# EAGLE design RC_BD_v2.1 (EAGLE 9.6.2)
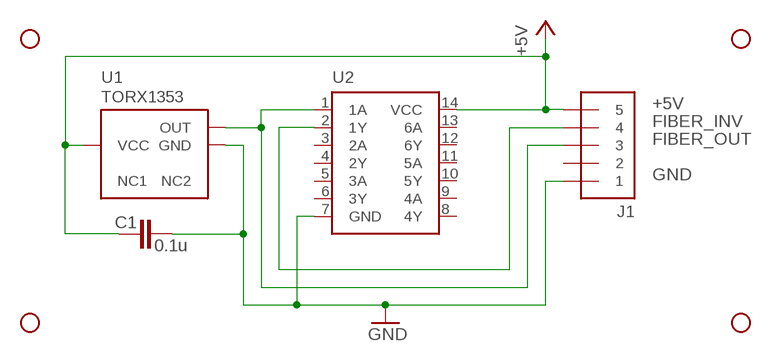
[diagram p0: schematic, sheet 1]

## Parts
C1  0.1u  C_CHIP-1206(3216-METRIC)  [CAPC3216X135]
H1  STAND-OFF  [STAND-OFF]
H2  STAND-OFF  [STAND-OFF]
H3  STAND-OFF  [STAND-OFF]
H4  STAND-OFF  [STAND-OFF]
J1  PPTC051LFBN-RC  [HDR-5-F]
U1  TORX1353  [TOXX1353]
U2  SN74HC04AN  [DIL14]

## Nets
+5V: C1.1 J1.5 U1.3(VCC) U2.14(VCC)
FIBER_INV: J1.4 U2.2(1Y)
FIBER_OUT: J1.3 U1.1(OUT) U2.1(1A)
GND: C1.2 J1.1 U1.2(GND) U2.7(GND)
Unconnected: J1.2 U1.4(NC1) U1.5(NC2) U2.3(2A) U2.4(2Y) U2.5(3A) U2.6(3Y) U2.8(4Y) U2.9(4A) U2.10(5Y) U2.11(5A) U2.12(6Y) U2.13(6A)

## Library data of the parts
C1 = Capacitor:C: Capacitor - Generic; CATEGORY: Capacitor
H1-H4 = SparkFun-Hardware:STAND-OFF: Stand Off Drill holes for mechanically mounting via screws, standoffs, etc. Note: Use the keepout ring to avoid running the screw head into surrounding components. Variant Overviews STAND-OFF - Mechanical footprint for a #4 phillips button head screw. STAND-OFF-TIGHT - Mechanical footprint for a #4 phillips button head screw, Example SparkFun Products Screw - Phillips Head (1/4", 4-40, 10 pack) <https://www.sparkfun.com/products/10453> (PRT-10453) Screw - Phillips Head (1/2", 4-40, 10 pack) <https://www.sparkfun.com/products/10452> (PRT-10452) Screw - Phillips Head (3/4", 4-40, 10 pack) <https://www.sparkfun.com/products/10451> (PRT-10451) Screw - Phillips Head (1", 4-40, 10 pack) <https://www.sparkfun.com/products/10450> (PRT-10450)
J1 = SD_LIB:PPTC051LFBN-RC
U1 = SD_LIB:TORX1353
U2 = SD_LIB:SN74HC04AN

## Board
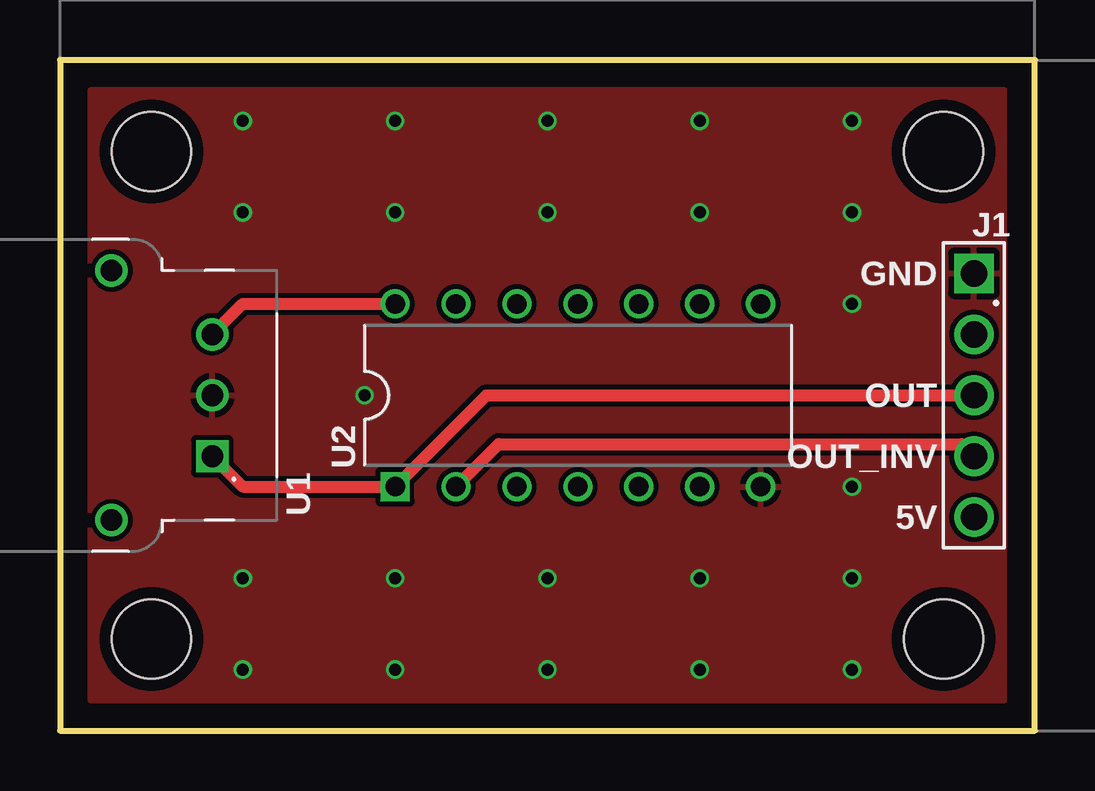
[diagram p1: board, top side]
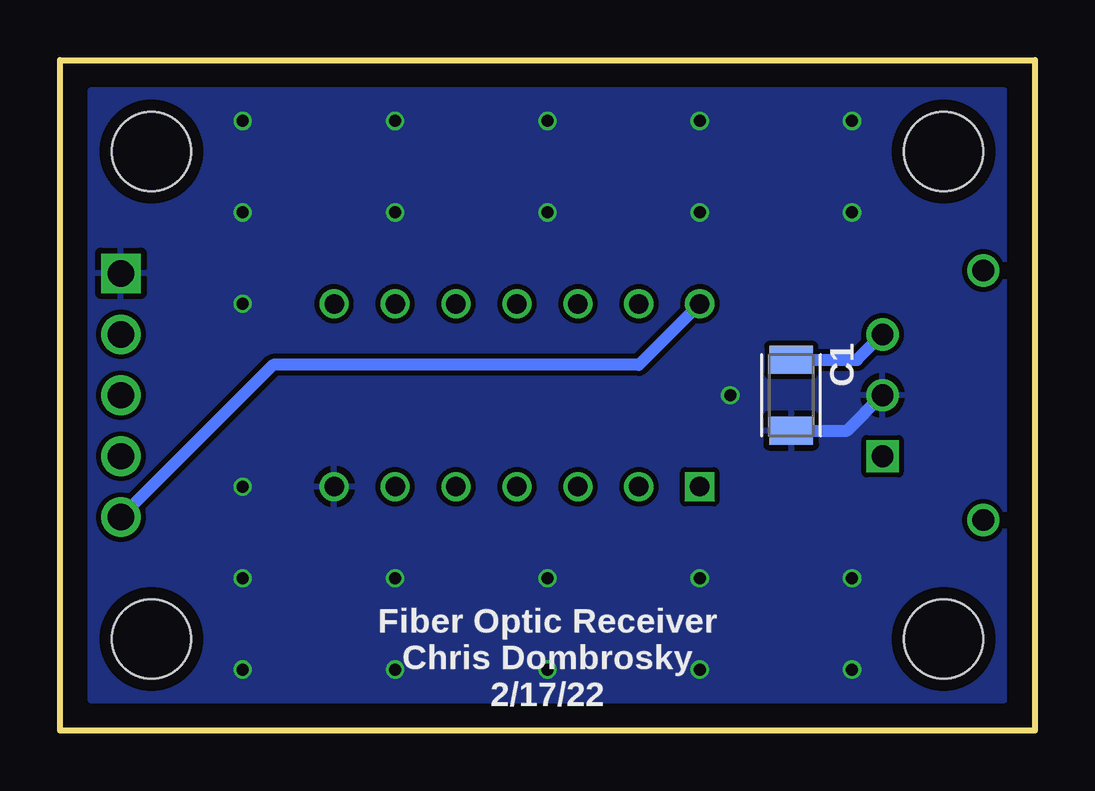
[diagram p2: board, bottom side, seen from below]

Size 40.64 x 27.94 mm. Coordinates in mm from the lower left corner, seen from the top.
Outline: 0,27.94 0,0 40.64,0 40.64,27.94 0,27.94
Copper layers (1*16): Top 0.035mm / dielectric 1.5mm / Bottom 0.035mm
Design rules "JLC": minimum track width 5mil, minimum drill 0.28mm, track to track 8mil, track to pad 0.2mm, pad to pad 0.5mm, via to via 0.5mm, smd to smd 8mil, copper to edge 0.5mm, drill to drill 0.5mm, minimum pad ring 0.13mm, minimum via ring 0.13mm, stop-mask expansion 0.05mm, vias tented up to drill 20mil, thermal gap 10mil

### Footprints (pad centres in the part's own frame; a part is rotated, then mirrored left to right if it is on the bottom)
CAPC3216X135 = smd 1.165 x 1.815: 1 -1.475,0; 2 1.475,0
STAND-OFF = hole 3.302: 0,0
HDR-5-F = drill 1.1 square: 1 1.27,1.27 | drill 1.1: 2 3.81,1.27; 3 6.35,1.27; 4 8.89,1.27; 5 11.43,1.27
TOXX1353 = drill 0.9 square: 1 -2.54,0 | drill 0.9: 2 0,0; 3 2.54,0; 4 5.2,4.2; 5 -5.2,4.2
DIL14 = drill 0.813 square: 1 -7.62,-3.81 | drill 0.813: 2 -5.08,-3.81; 3 -2.54,-3.81; 4 0,-3.81; 5 2.54,-3.81; 6 5.08,-3.81; 7 7.62,-3.81; 8 7.62,3.81; 9 5.08,3.81; 10 2.54,3.81; 11 0,3.81; 12 -2.54,3.81; 13 -5.08,3.81; 14 -7.62,3.81

### Placement (x,y rotation side)
C1  10.16,13.97 270 bottom
H1  3.81,24.13 0 top
H2  36.83,24.13 0 top
H3  3.81,3.81 0 top
H4  36.83,3.81 0 top
J1  36.83,20.32 270 top
U1  6.35,13.97 90 top
U2  21.59,13.97 0 top

### Tracks (layer width: path | path; a pad name or v marks a point on that pad's centre or on a via)
+5V
  Top 0.508: U1.3 7.62,17.78 U2.14
  Bottom 0.508: C1.1 7.42,15.45 U1.3 | U2.14 16.51,15.24 31.75,15.24 J1.5
FIBER_INV
  Top 0.508: J1.4 37.59,11.94 18.29,11.94 U2.2
FIBER_OUT
  Top 0.508: U1.1 7.62,10.16 U2.1 17.78,13.97 J1.3
GND  (via drill 0.5)
  Bottom 0.508: C1.2 7.83,12.5 U1.2
  other vias: 7.62,2.54 33.02,2.54 33.02,25.4 7.62,25.4 7.62,21.59 33.02,21.59 33.02,6.35 7.62,6.35 13.97,2.54 13.97,6.35 26.67,2.54 26.67,6.35 20.32,6.35 20.32,2.54 13.97,21.59 13.97,25.4 20.32,21.59 20.32,25.4 26.67,25.4 26.67,21.59 12.7,13.97 33.02,17.78 33.02,10.16
  pour Bottom: 39.37,26.67 39.37,1.27 1.27,1.27 1.27,26.67
  pour Top: 1.27,26.67 1.27,1.27 39.37,1.27 39.37,26.67

### Text on the board
bPlace: Fiber Optic Receiver / Chris Dombrosky / 2/17/22
tNames: GND | OUT | OUT_INV | 5V